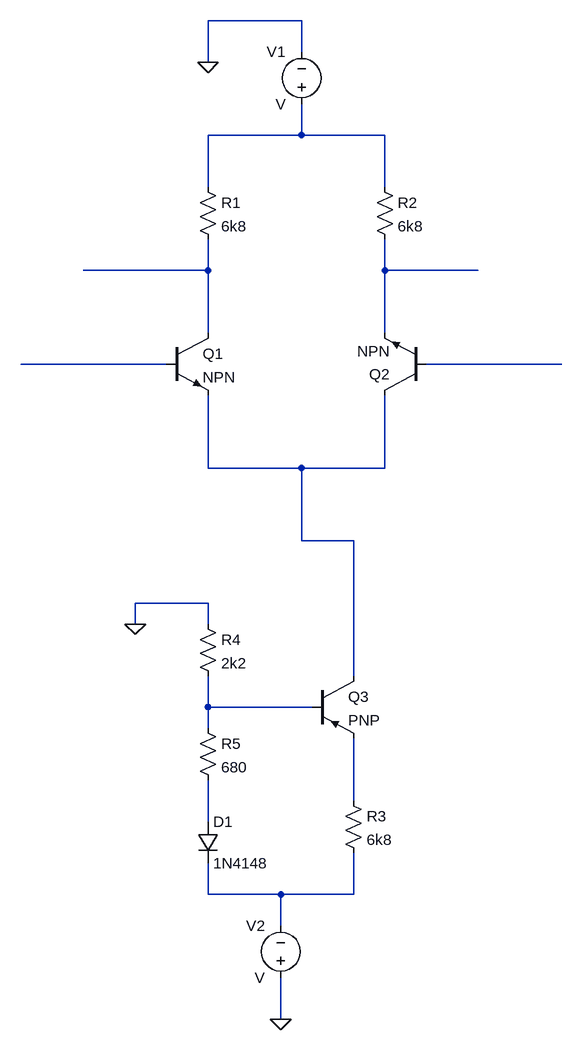
[diagram p0: schematic TP2-Opcion1.asc]
TP2-Opcion1.asc, the LTspice schematic file:
Version 4
SHEET 1 880 1204
WIRE 336 -352 192 -352
WIRE 336 -304 336 -352
WIRE 192 -288 192 -352
WIRE 336 -176 336 -224
WIRE 336 -176 192 -176
WIRE 464 -176 336 -176
WIRE 192 -96 192 -176
WIRE 464 -96 464 -176
WIRE 192 32 192 -16
WIRE 192 32 0 32
WIRE 464 32 464 -16
WIRE 608 32 464 32
WIRE 192 128 192 32
WIRE 464 128 464 32
WIRE 128 176 -96 176
WIRE 736 176 528 176
WIRE 192 336 192 224
WIRE 336 336 192 336
WIRE 464 336 464 224
WIRE 464 336 336 336
WIRE 336 448 336 336
WIRE 416 448 336 448
WIRE 192 544 80 544
WIRE 80 576 80 544
WIRE 192 576 192 544
WIRE 416 656 416 448
WIRE 192 704 192 656
WIRE 352 704 192 704
WIRE 192 736 192 704
WIRE 416 848 416 752
WIRE 192 880 192 816
WIRE 192 992 192 944
WIRE 304 992 192 992
WIRE 416 992 416 928
WIRE 416 992 304 992
WIRE 304 1040 304 992
WIRE 304 1184 304 1120
FLAG 80 576 0
FLAG 192 -288 0
FLAG 304 1184 0
SYMBOL npn 128 128 R0
SYMATTR InstName Q1
SYMBOL npn 528 224 R180
SYMATTR InstName Q2
SYMBOL res 176 -112 R0
SYMATTR InstName R1
SYMATTR Value 6k8
SYMBOL res 448 -112 R0
SYMATTR InstName R2
SYMATTR Value 6k8
SYMBOL voltage 336 -208 R180
WINDOW 0 24 96 Left 2
WINDOW 3 24 16 Left 2
SYMATTR InstName V1
SYMBOL res 400 832 R0
SYMATTR InstName R3
SYMATTR Value 6k8
SYMBOL res 176 560 R0
SYMATTR InstName R4
SYMATTR Value 2k2
SYMBOL res 176 720 R0
SYMATTR InstName R5
SYMATTR Value 680
SYMBOL diode 176 880 R0
SYMATTR InstName D1
SYMATTR Value 1N4148
SYMBOL pnp 352 656 R0
SYMATTR InstName Q3
SYMBOL voltage 304 1136 R180
WINDOW 0 24 96 Left 2
WINDOW 3 24 16 Left 2
SYMATTR InstName V2

The netlist it stands for:
* TP2-Opcion1.asc
Q1 N002 N004 N006 0 NPN
Q2 N006 N005 N003 0 NPN
R1 N001 N002 6k8
R2 N001 N003 6k8
V1 N001 0 V
R3 N008 N010 6k8
R4 0 N007 2k2
R5 N007 N009 680
D1 N009 N010 1N4148
Q3 N006 N007 N008 0 PNP
V2 0 N010 V
.model D D
.lib standard.dio
.model NPN NPN
.model PNP PNP
.lib standard.bjt
.backanno
.end